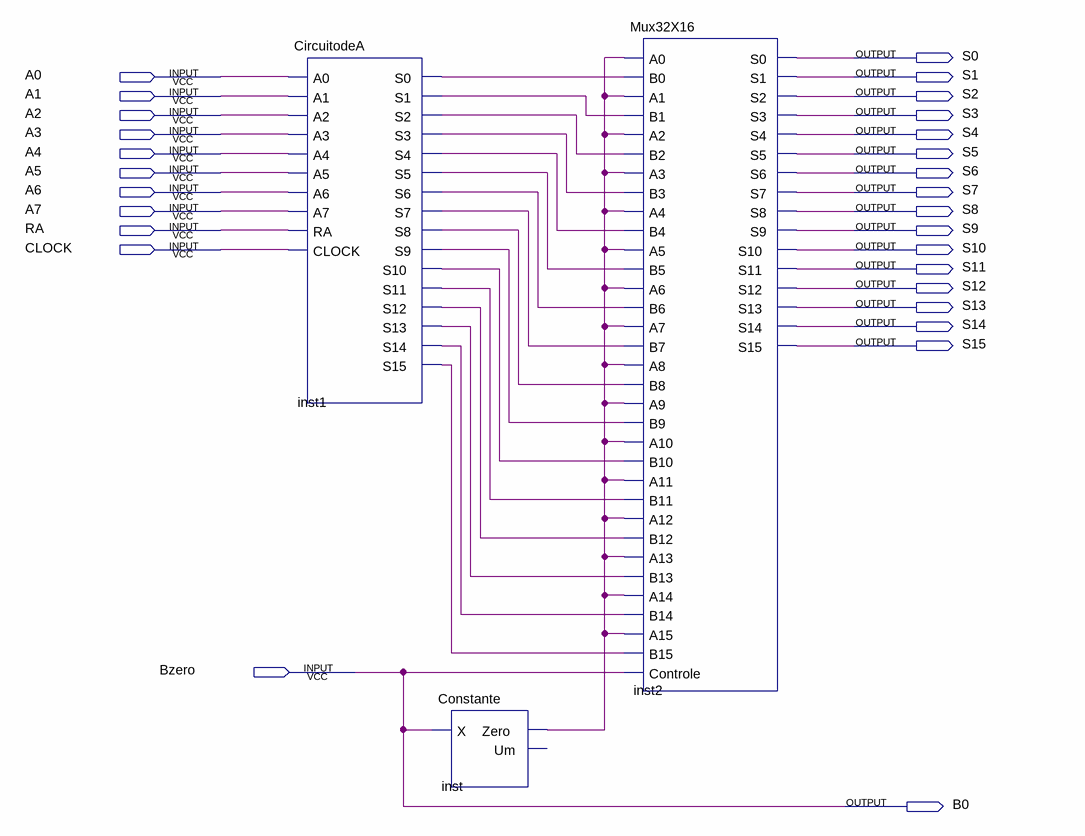
[diagram p0: schematic sheet]
// Quartus schematic SelecaodSoma.bdf as structural Verilog: 3 symbols, 28 pins
module SelecaodSoma (
  input  A0,
  input  A1,
  input  A2,
  input  A3,
  input  A4,
  input  A5,
  input  A6,
  input  A7,
  input  RA,
  input  CLOCK,
  input  Bzero,
  output S0,
  output S1,
  output S2,
  output S3,
  output S4,
  output S5,
  output S6,
  output S7,
  output S8,
  output S9,
  output S10,
  output S11,
  output S12,
  output S13,
  output S14,
  output S15,
  output B0
);

  wire inst1_s0, inst1_s1, inst1_s2, inst1_s3, inst1_s4, inst1_s5, inst1_s6, inst1_s7, inst1_s8, inst1_s9,
       inst1_s10, inst1_s11, inst1_s12, inst1_s13, inst1_s14, inst1_s15, inst_zero;

  CircuitodeA inst1 (
    .A0(A0), .A1(A1), .A2(A2), .A3(A3), .A4(A4), .A5(A5), .A6(A6), .A7(A7), .RA(RA), .CLOCK(CLOCK),
    .S0(inst1_s0), .S1(inst1_s1), .S2(inst1_s2), .S3(inst1_s3), .S4(inst1_s4), .S5(inst1_s5), .S6(inst1_s6),
    .S7(inst1_s7), .S8(inst1_s8), .S9(inst1_s9), .S10(inst1_s10), .S11(inst1_s11), .S12(inst1_s12),
    .S13(inst1_s13), .S14(inst1_s14), .S15(inst1_s15));
  Constante inst (.X(Bzero), .Zero(inst_zero));  // open: Um
  Mux32X16 inst2 (
    .A0(inst_zero), .B0(inst1_s0), .A1(inst_zero), .B1(inst1_s1), .A2(inst_zero), .B2(inst1_s2),
    .A3(inst_zero), .B3(inst1_s3), .A4(inst_zero), .B4(inst1_s4), .A5(inst_zero), .B5(inst1_s5),
    .A6(inst_zero), .B6(inst1_s6), .A7(inst_zero), .B7(inst1_s7), .A8(inst_zero), .B8(inst1_s8),
    .A9(inst_zero), .B9(inst1_s9), .A10(inst_zero), .B10(inst1_s10), .A11(inst_zero), .B11(inst1_s11),
    .A12(inst_zero), .B12(inst1_s12), .A13(inst_zero), .B13(inst1_s13), .A14(inst_zero), .B14(inst1_s14),
    .A15(inst_zero), .B15(inst1_s15), .Controle(Bzero), .S0(S0), .S1(S1), .S2(S2), .S3(S3), .S4(S4), .S5(S5),
    .S6(S6), .S7(S7), .S8(S8), .S9(S9), .S10(S10), .S11(S11), .S12(S12), .S13(S13), .S14(S14), .S15(S15));

  assign B0 = Bzero;
endmodule
